# EAGLE design board (EAGLE 9.4.0)
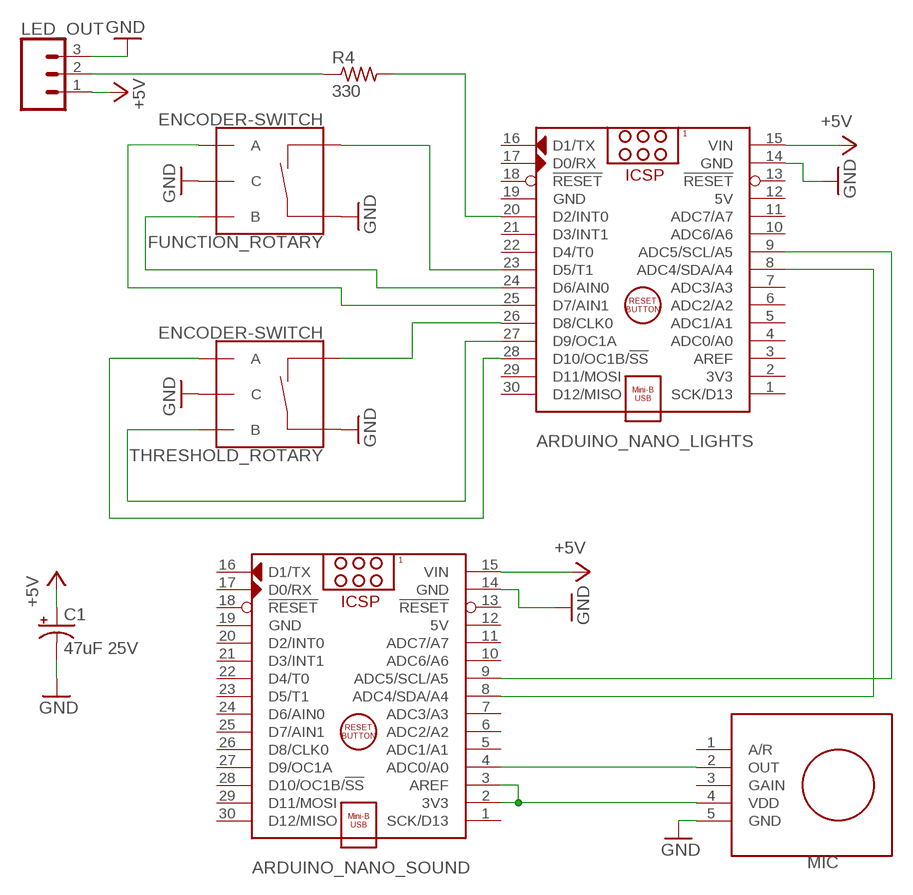
[diagram p0: schematic, sheet 1]

## Parts
ARDUINO_NANO_LIGHTS  ARDUINO_NANO  [ARDUINO_NANO]
ARDUINO_NANO_SOUND  ARDUINO_NANO  [ARDUINO_NANO]
C1  47uF 25V  CPOL-USE2-5  [E2-5]
FUNCTION_ROTARY  ENCODER-SWITCH  [ROTARY_ENC_PLAIN]
LED_OUT  CONN_03  [1X03]
MIC  ADAFRUIT_ELECTRET_MIC_MAX9817  [ADAFRUIT_ELECTRET_MIC_MAX9817]
R4  330  R-US_0207/7  [0207/7]
THRESHOLD_ROTARY  ENCODER-SWITCH  [ROTARY_ENC_PLAIN]

## Nets
+5V [PWR]: ARDUINO_NANO_LIGHTS.15(VIN) ARDUINO_NANO_SOUND.15(VIN) C1.+ LED_OUT.1
GND [PWR]: ARDUINO_NANO_LIGHTS.14(GND) ARDUINO_NANO_SOUND.14(GND) C1.- FUNCTION_ROTARY.C FUNCTION_ROTARY.SW+ LED_OUT.3 MIC.5(GND) THRESHOLD_ROTARY.C THRESHOLD_ROTARY.SW+
LED_OUT: ARDUINO_NANO_LIGHTS.20(D2/INT0) R4.2
MIC_VCC: ARDUINO_NANO_SOUND.2(3V3) ARDUINO_NANO_SOUND.3(AREF) MIC.4(VDD)
N$1: ARDUINO_NANO_LIGHTS.26(D8/CLK0) THRESHOLD_ROTARY.SW-
N$2: ARDUINO_NANO_LIGHTS.27(D9/OC1A) THRESHOLD_ROTARY.B
N$3: ARDUINO_NANO_LIGHTS.23(D5/T1) FUNCTION_ROTARY.SW-
N$4: ARDUINO_NANO_LIGHTS.24(D6/AIN0) FUNCTION_ROTARY.B
N$5: ARDUINO_NANO_SOUND.4(ADC0/A0) MIC.2(OUT)
N$12: ARDUINO_NANO_LIGHTS.9(ADC5/SCL/A5) ARDUINO_NANO_SOUND.9(ADC5/SCL/A5)
N$13: ARDUINO_NANO_LIGHTS.25(D7/AIN1) FUNCTION_ROTARY.A
N$15: ARDUINO_NANO_LIGHTS.28(D10/OC1B/!SS) THRESHOLD_ROTARY.A
N$18: ARDUINO_NANO_LIGHTS.8(ADC4/SDA/A4) ARDUINO_NANO_SOUND.8(ADC4/SDA/A4)
N$20: LED_OUT.2 R4.1
Unconnected: ARDUINO_NANO_LIGHTS.1(SCK/D13) ARDUINO_NANO_LIGHTS.2(3V3) ARDUINO_NANO_LIGHTS.3(AREF) ARDUINO_NANO_LIGHTS.4(ADC0/A0) ARDUINO_NANO_LIGHTS.5(ADC1/A1) ARDUINO_NANO_LIGHTS.6(ADC2/A2) ARDUINO_NANO_LIGHTS.7(ADC3/A3) ARDUINO_NANO_LIGHTS.10(ADC6/A6) ARDUINO_NANO_LIGHTS.11(ADC7/A7) ARDUINO_NANO_LIGHTS.13(!RESET) ARDUINO_NANO_LIGHTS.16(D1/TX) ARDUINO_NANO_LIGHTS.17(D0/RX) ARDUINO_NANO_LIGHTS.18(!RESET) ARDUINO_NANO_LIGHTS.21(D3/INT1) ARDUINO_NANO_LIGHTS.22(D4/T0) ARDUINO_NANO_LIGHTS.29(D11/MOSI) ARDUINO_NANO_LIGHTS.30(D12/MISO) ARDUINO_NANO_SOUND.1(SCK/D13) ARDUINO_NANO_SOUND.5(ADC1/A1) ARDUINO_NANO_SOUND.6(ADC2/A2) ARDUINO_NANO_SOUND.7(ADC3/A3) ARDUINO_NANO_SOUND.10(ADC6/A6) ARDUINO_NANO_SOUND.11(ADC7/A7) ARDUINO_NANO_SOUND.13(!RESET) ARDUINO_NANO_SOUND.16(D1/TX) ARDUINO_NANO_SOUND.17(D0/RX) ARDUINO_NANO_SOUND.18(!RESET) ARDUINO_NANO_SOUND.20(D2/INT0) ARDUINO_NANO_SOUND.21(D3/INT1) ARDUINO_NANO_SOUND.22(D4/T0) ARDUINO_NANO_SOUND.23(D5/T1) ARDUINO_NANO_SOUND.24(D6/AIN0) ARDUINO_NANO_SOUND.25(D7/AIN1) ARDUINO_NANO_SOUND.26(D8/CLK0) ARDUINO_NANO_SOUND.27(D9/OC1A) ARDUINO_NANO_SOUND.28(D10/OC1B/!SS) ARDUINO_NANO_SOUND.29(D11/MOSI) ARDUINO_NANO_SOUND.30(D12/MISO) MIC.1(A/R) MIC.3(GAIN)

## Power pins joined to a net without a drawn wire
5V: ARDUINO_NANO_LIGHTS.12(5V) ARDUINO_NANO_SOUND.12(5V)
GND: ARDUINO_NANO_LIGHTS.19(GND) ARDUINO_NANO_SOUND.19(GND)

## Library data of the parts
ARDUINO_NANO_LIGHTS ARDUINO_NANO_SOUND = ArduinoNanoV30:ARDUINO_NANO: Arduino Nano V3.0 Module Overview: The Arduino Nano is a small, complete, and breadboard-friendly board based on the ATmega328 (Arduino Nano 3.x) or ATmega168 (Arduino Nano 2.x). It has more or less the same functionality of the Arduino Duemilanove, but in a different package. It lacks only a DC power jack, and works with a Mini-B USB cable instead of a standard one. The Nano was designed and is being produced by Gravitech <http://www.gravitech.us/arna30wiatp.html>. General specifications: Item Value Microcontroller Atmel ATmega168 or ATmega328 Operating Voltage (logic level) 5 V Input Voltage (recommended) 7-12 V Input Voltage (limits) 6-20 V Digital I/O Pins 14 (of which 6 provide PWM output) Analog Input Pins 8 DC Current per I/O Pin 40 mA Flash Memory 16 KB (ATmega168) or 32 KB (ATmega328) of which 2 KB used by bootloader SRAM 1 KB (ATmega168) or 2 KB (ATmega328) EEPROM 512 bytes (ATmega168) or 1 KB (ATmega328) Clock Speed 16 MHz Dimensions (Inches) 0.73" x 1.70" Dimensions (mm) 18mm x 45mm Overall height About 9 mm (not including pins) Weigth 5 g Power: The Arduino Nano can be powered via the Mini-B USB connection, 6-20V unregulated external power supply (pin 30), or 5V regulated external power supply (pin 27). The power source is automatically selected to the highest voltage source. Memory: The ATmega168 has 16 KB of flash memory for storing code (of which 2 KB is used for the bootloader); the ATmega328 has 32 KB, (also with 2 KB used for the bootloader). The ATmega168 has 1 KB of SRAM and 512 bytes of EEPROM (which can be read and written with the EEPROM library); the ATmega328 has 2 KB of SRAM and 1 KB of EEPROM. Input and Output: Each of the 14 digital pins on the Nano can be used as an input or output, using pinMode(), digitalWrite(), and digitalRead() functions. They operate at 5 volts. Each pin can provide or receive a maximum of 40 mA and has an internal pull-up resistor (disconnected by default) of 20-50 kOhms. In addition, some pins have specialized functions. Visit Arduino - ArduinoBoardNano <https://www.arduino.cc/en/Main/ArduinoBoardNano>
C1 = adafruit:CPOL-US: POLARIZED CAPACITOR, American symbol
FUNCTION_ROTARY THRESHOLD_ROTARY = SparkFun-Switches:ENCODER-SWITCH: Rotary Encoder w/ Select Switch Encoders rotate similarly to potentiometers, but they’re different from potentiometers in that an encoder has full rotation without limits. They output gray code so that you can tell how much and in which direction the encoder has been turned. This encoder includes a push-down select switch built into the shaft. SparkFun Products Rotary Encoder <https://www.sparkfun.com/products/9117> (COM-09117); SF_SKU: COM-09117
LED_OUT = SparkFun-Connectors:CONN_03: Multi connection point. Often used as Generic Header-pin footprint for 0.1 inch spaced/style header connections On any of the 0.1 inch spaced packages, you can populate with these: Break Away Headers - Straight <https://www.sparkfun.com/products/116> (PRT-00116) Break Away Male Headers - Right Angle <https://www.sparkfun.com/products/553> (PRT-00553) Female Headers <https://www.sparkfun.com/products/115> (PRT-00115) Break Away Headers - Machine Pin <https://www.sparkfun.com/products/117> (PRT-00117) Break Away Female Headers - Swiss Machine Pin <https://www.sparkfun.com/products/743> (PRT-00743) Stackable Header - 3 Pin (Female, 0.1") <https://www.sparkfun.com/products/13875> (PRT-13875) For SCREWTERMINALS and SPRING TERMINALS visit here: Screw Terimnals on SparkFun.com <https://www.sparkfun.com/search/results?term=Screw+Terminals> (5mm/3.5mm/2.54mm spacing) This device is also useful as a general connection point to wire up your design to another part of your project. Our various solder wires solder well into these plated through hole pads. Hook-Up Wire - Assortment (Stranded, 22 AWG) <https://www.sparkfun.com/products/11375> (PRT-11375) Hook-Up Wire - Assortment (Solid Core, 22 AWG) <https://www.sparkfun.com/products/11367> (PRT-11367) View the entire wire category on our website here <https://www.sparkfun.com/categories/141> Special notes: Molex polarized connector foot print use with SKU : PRT-08232 with associated crimp pins and housings.
MIC = toepferg:ADAFRUIT_ELECTRET_MIC_MAX9817
R4 = adafruit:R-US_: RESISTOR, American symbol

## Net classes
1 PWR: width 0.406 mm

## Board
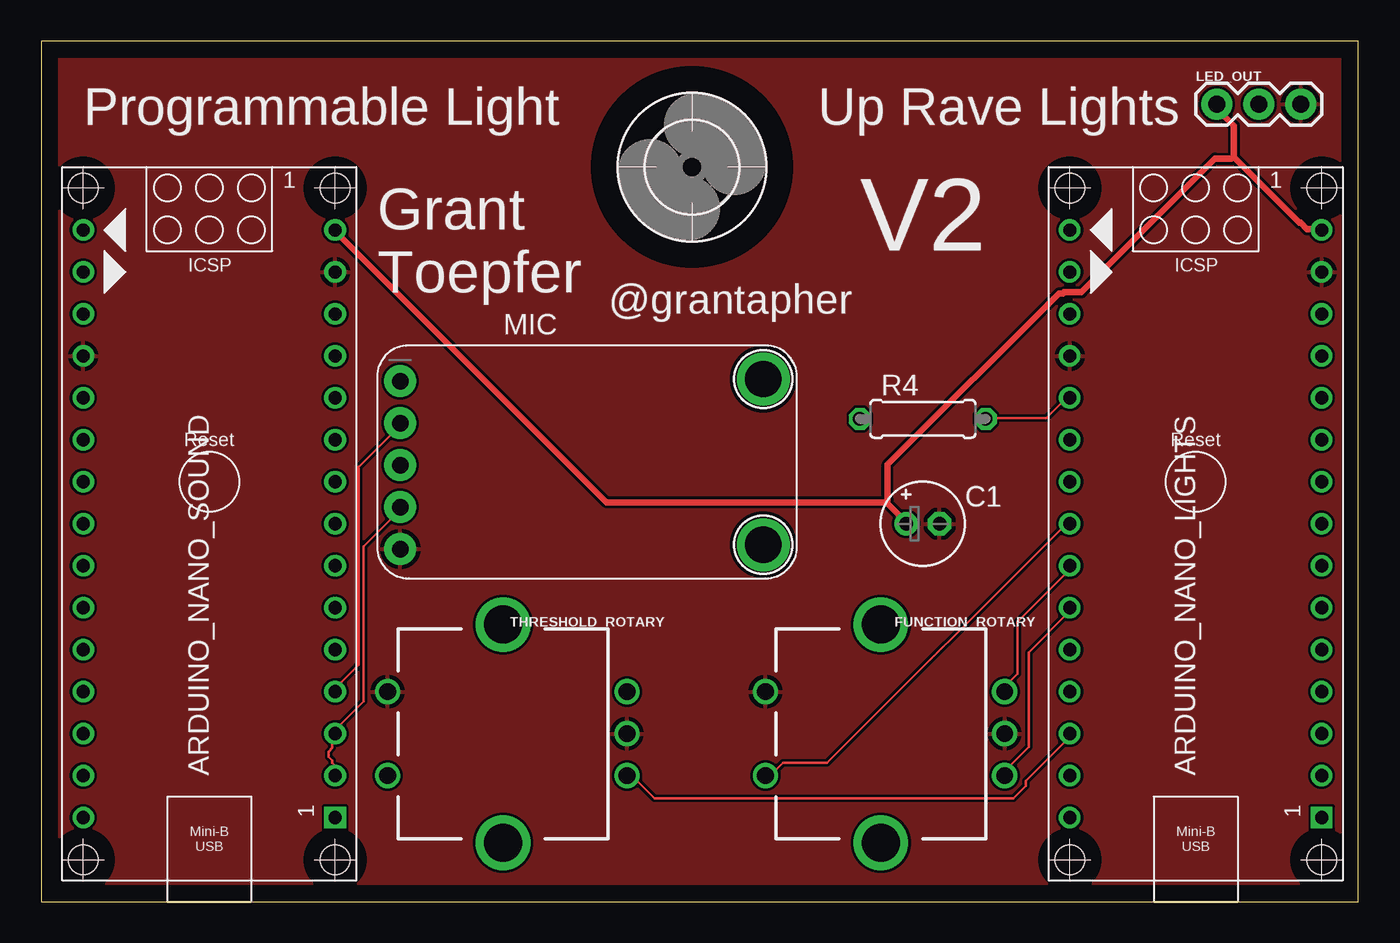
[diagram p1: board, top side]
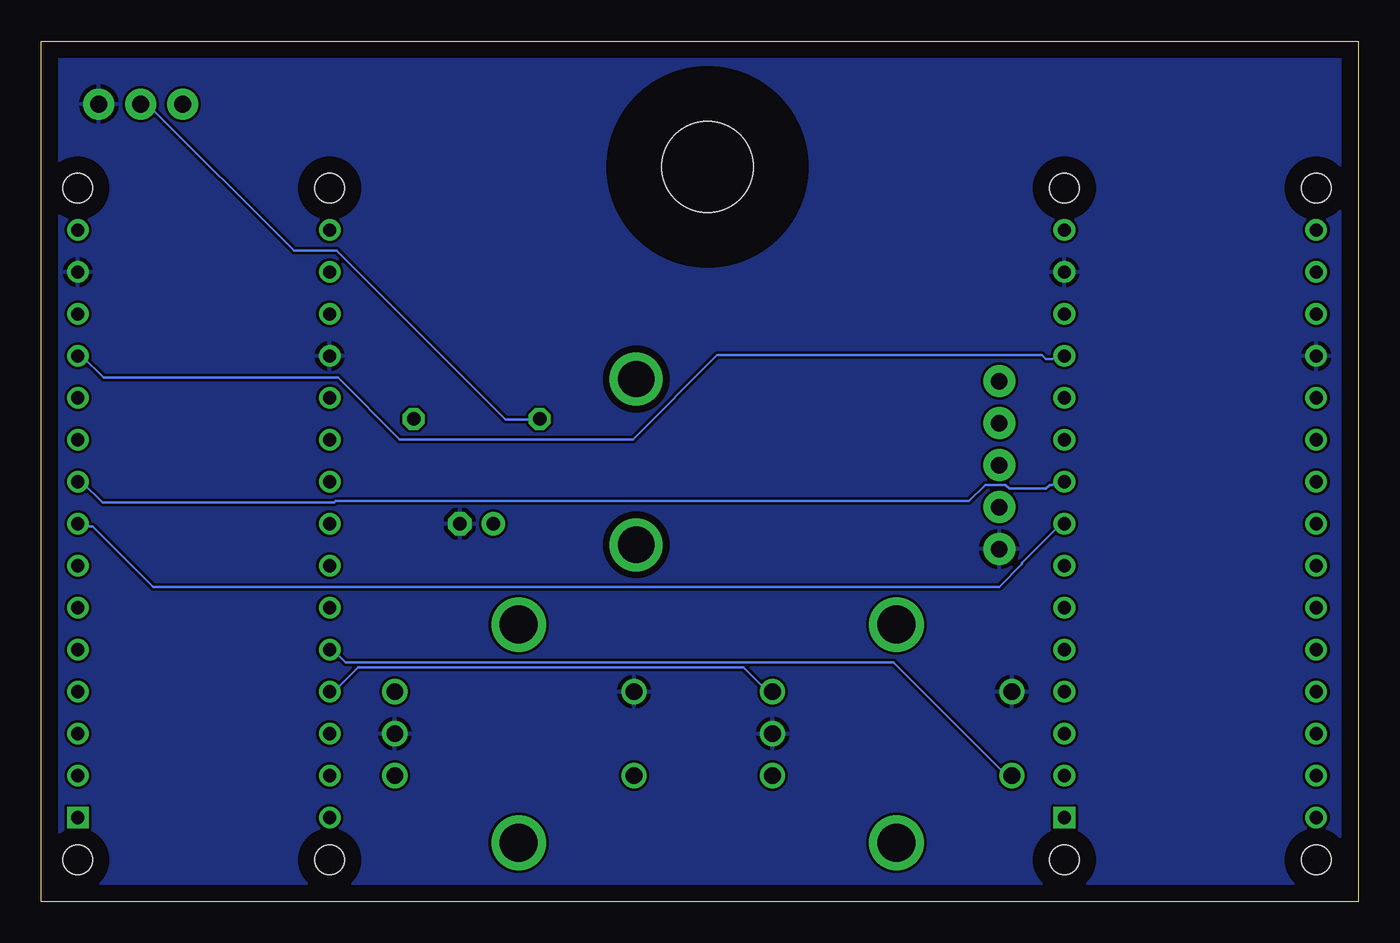
[diagram p2: board, bottom side, seen from below]

Size 79.68 x 52.06 mm. Coordinates in mm from the lower left corner, seen from the top.
Outline: 0,0 79.68,0 79.68,52.06 0,52.06 0,0
Copper layers (1*16): Top 0.035mm / dielectric 1.5mm / Bottom 0.035mm
Design rules "default": minimum track width 6mil, minimum drill 0.35mm, track to track 6mil, track to pad 6mil, pad to pad 6mil, via to via 6mil, smd to smd 6mil, copper to edge 40mil, drill to drill 6mil, minimum pad ring 10mil, minimum via ring 8mil, stop-mask expansion 4mil, vias tented up to drill 0mil, thermal gap 10mil

### Footprints (pad centres in the part's own frame; a part is rotated, then mirrored left to right if it is on the bottom)
ARDUINO_NANO = drill 0.8 square: 1 -20.32,-7.62 | drill 0.8: 2 -17.78,-7.62; 3 -15.24,-7.62; 4 -12.7,-7.62; 5 -10.16,-7.62; 6 -7.62,-7.62; 7 -5.08,-7.62; 8 -2.54,-7.62; 9 0,-7.62; 10 2.54,-7.62; 11 5.08,-7.62; 12 7.62,-7.62; 13 10.16,-7.62; 14 12.7,-7.62; 15 15.24,-7.62; 16 15.24,7.62; 17 12.7,7.62; 18 10.16,7.62; 19 7.62,7.62; 20 5.08,7.62; 21 2.54,7.62; 22 0,7.62; 23 -2.54,7.62; 24 -5.08,7.62; 25 -7.62,7.62; 26 -10.16,7.62; 27 -12.7,7.62; 28 -15.24,7.62; 29 -17.78,7.62; 30 -20.32,7.62 | hole 1.778: -22.86,-7.62; -22.86,7.62; 17.78,7.62; 17.78,-7.62
E2-5 = drill 0.813 pad 1.422: + -1.016,0 | drill 0.813 pad 1.422 octagon: - 1.016,0
ROTARY_ENC_PLAIN = drill 1.016: A 7.493,-2.54; B 7.493,2.54; C 7.493,0; SW+ -6.985,2.54; SW- -6.985,-2.54 | drill 2.286: P$3 0,6.604; P$4 0,-6.604
1X03 = drill 1.016 pad 1.88: 1 0,0; 2 2.54,0; 3 5.08,0
ADAFRUIT_ELECTRET_MIC_MAX9817 = drill 1 pad 1.93: 1 -11.303,4.826; 2 -11.303,2.286; 3 -11.303,-0.254; 4 -11.303,-2.794; 5 -11.303,-5.334 | drill 2.2 pad 3: P$1 10.668,4.953; P$2 10.668,-5.08
0207/7 = drill 0.813 octagon: 1 -3.81,0; 2 3.81,0
5,5 = hole 5.5: 0,0

### Placement (x,y rotation side)
ARDUINO_NANO_LIGHTS  69.85,25.4 90 top
ARDUINO_NANO_SOUND  10.16,25.4 90 top
C1  53.34,22.86 0 top
FUNCTION_ROTARY  50.8,10.16 0 top
LED_OUT  71.12,48.26 0 top
MIC  33.02,26.67 0 top
R4  53.34,29.21 0 top
THRESHOLD_ROTARY  27.94,10.16 0 top
U$1  [5,5]  39.37,44.45 0 top

### Tracks (layer width: path | path; a pad name or v marks a point on that pad's centre or on a via)
5V
  Bottom 0.152: ARDUINO_NANO_SOUND.12 17.83,32.99 18.36,32.99 18.52,32.84 18.9,32.84 19.13,33.07 38.79,33.07 43.89,27.96 57.99,27.96 61.72,31.7 75.89,31.7 77.19,32.99 77.42,32.99 ARDUINO_NANO_LIGHTS.12
+5V
  Top 0.406: 72.16,45.03 76.12,41.07 76.2,41.07 76.58,40.69 77.42,40.69 ARDUINO_NANO_LIGHTS.15 | 72.16,45.03 72.16,46.94 71.17,47.93 71.17,48.23 LED_OUT.1 | 51.13,24.16 34.21,24.16 18.06,40.31 18.06,40.39 17.83,40.62 ARDUINO_NANO_SOUND.15 | 51.13,24.16 52.27,23.01 52.27,22.86 C1.+ | 72.16,45.03 72.01,44.96 71.02,44.96 62.94,36.88 61.87,36.88 61.8,36.8 61.57,36.8 51.21,26.44 51.21,24.31 51.13,24.16
GND
  pour Top: -1.27,53.34 -1.27,-1.27 81.28,-1.27 81.28,53.34
  pour Bottom: -2.54,54.61 -2.54,-2.54 82.55,-2.54 82.55,54.61
LED_OUT
  Top 0.152: ARDUINO_NANO_LIGHTS.20 62.03,30.48 60.81,29.26 57.15,29.26 R4.2
MIC_VCC
  Top 0.152: ARDUINO_NANO_SOUND.2 17.75,7.62 17.75,8.23 17.6,8.38 17.6,8.53 17.37,8.76 17.37,9.07 17.6,9.3 17.6,9.53 17.75,9.68 17.75,10.13 ARDUINO_NANO_SOUND.3 17.83,10.21 17.83,10.44 19.51,12.12 19.51,21.49 21.72,23.7 MIC.4
N$1
  Bottom 0.152: ARDUINO_NANO_LIGHTS.26 62.03,15.24 61.27,14.48 28.12,14.48 21.26,7.62 THRESHOLD_ROTARY.SW-
N$2
  Bottom 0.152: ARDUINO_NANO_LIGHTS.27 62.18,12.72 61.95,12.72 60.5,14.17 37.19,14.17 35.74,12.72 35.43,12.72 THRESHOLD_ROTARY.B
N$3
  Top 0.152: ARDUINO_NANO_LIGHTS.23 62.03,22.86 47.55,8.38 44.88,8.38 44.12,7.62 FUNCTION_ROTARY.SW-
N$4
  Top 0.152: FUNCTION_ROTARY.B 58.29,13.03 59.05,13.79 59.05,16.92 62.18,20.04 62.18,20.27 ARDUINO_NANO_LIGHTS.24
N$5
  Top 0.152: MIC.2 21.72,28.8 19.2,26.29 19.2,14.33 17.83,12.95 17.83,12.72 ARDUINO_NANO_SOUND.4
N$12
  Bottom 0.152: ARDUINO_NANO_SOUND.9 17.83,25.38 18.36,25.38 18.52,25.22 18.67,25.22 18.9,24.99 21.11,24.99 21.34,25.22 22.55,25.22 23.55,24.23 61.87,24.23 61.95,24.16 75.97,24.16 77.19,25.38 77.42,25.38 ARDUINO_NANO_LIGHTS.9
N$13
  Top 0.152: FUNCTION_ROTARY.A 58.29,7.92 59.74,9.37 59.74,15.09 62.18,17.53 62.18,17.75 ARDUINO_NANO_LIGHTS.25
N$15
  Top 0.152: THRESHOLD_ROTARY.A 35.74,7.62 37.11,6.25 58.83,6.25 59.59,7.01 59.59,7.32 62.18,9.91 62.18,10.13 ARDUINO_NANO_LIGHTS.28
N$18
  Bottom 0.152: ARDUINO_NANO_SOUND.8 17.98,22.86 20.34,20.5 20.34,20.42 21.72,19.05 72.92,19.05 76.58,22.71 76.81,22.71 76.96,22.86 ARDUINO_NANO_LIGHTS.8
N$20
  Bottom 0.152: R4.1 49.53,29.18 51.59,29.18 61.8,39.4 64.39,39.4 73.23,48.23 73.61,48.23 LED_OUT.2

### Text on the board
tPlace: Programmable Light | Up Rave Lights | Grant | V2 | Toepfer | @grantapher